# Altium schematic sheet BMS_Interface.SchDoc: BMS Interface
size Letter; Author: Kevin Chen; DocumentNumber: 3; SheetNumber: 3; SheetTotal: 4; Website: www.uwmidsun.com
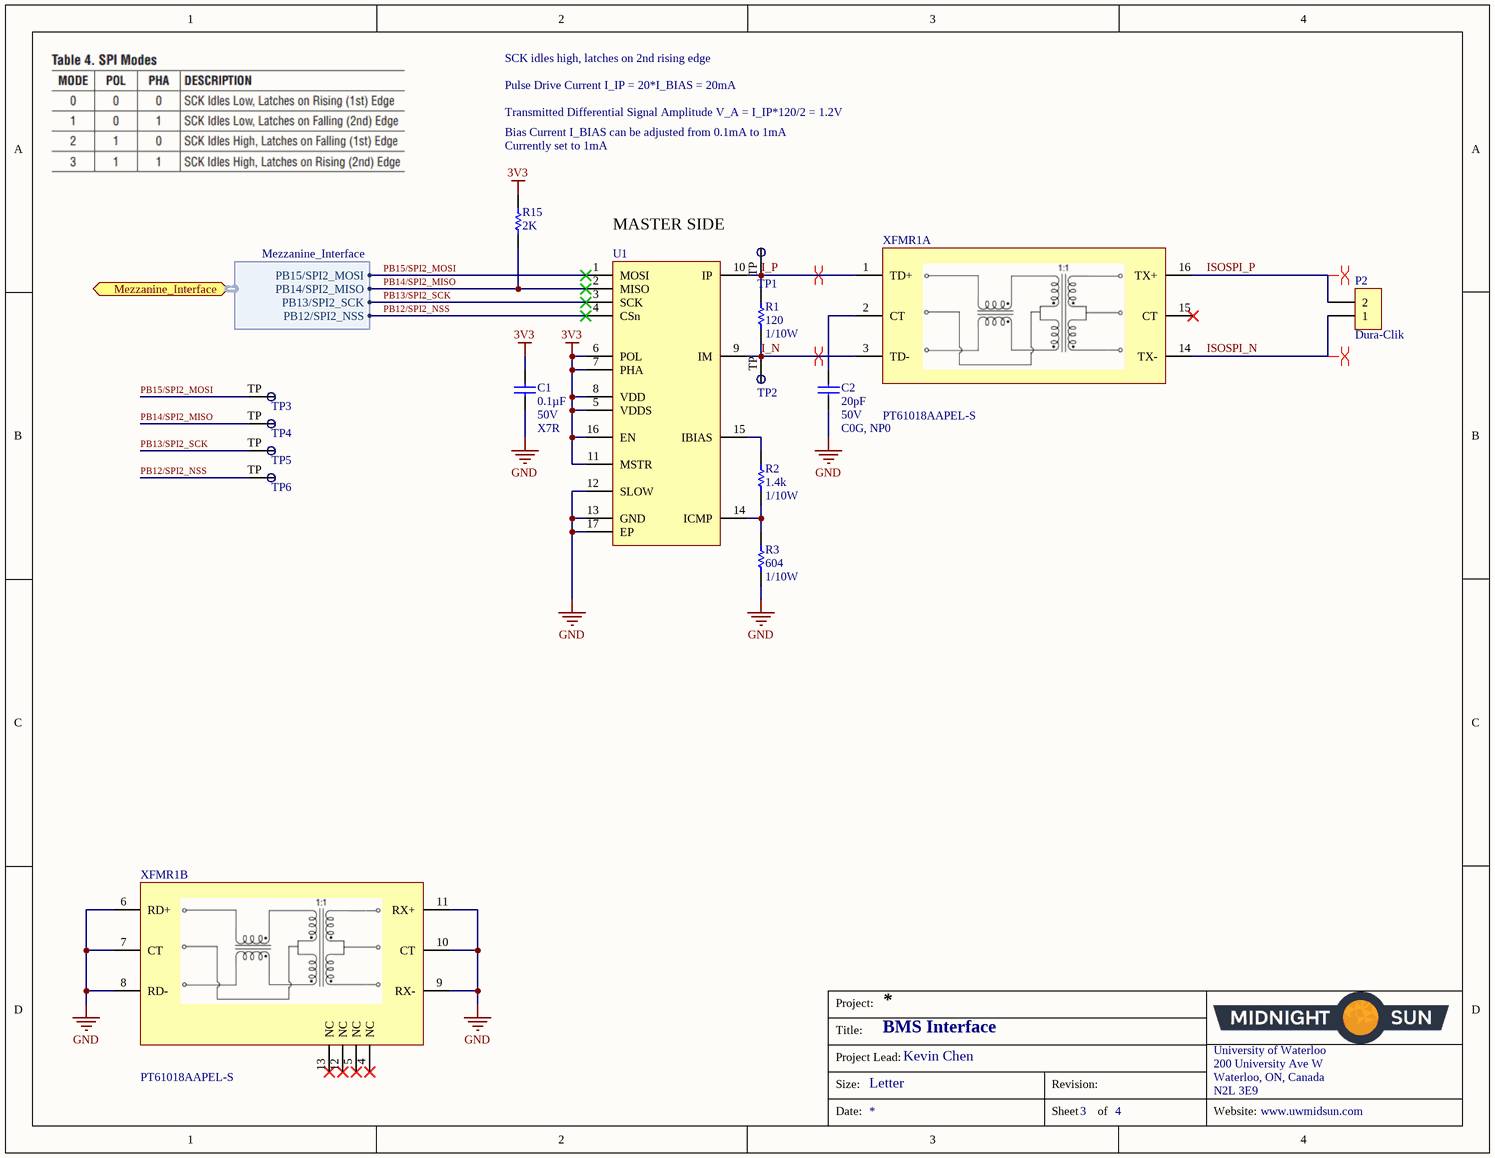
[diagram p0: BMS_Interface.SchDoc]

## Parts
C1  Capacitance: 0.1µF  Voltage: 50V  Temperature Coefficient: X7R  [CAP, 0603]  (hidden comment: CAP CER 0.1UF 50V 10% X7R 0603)
C2  Capacitance: 20pF  Voltage: 50V  Temperature Coefficient: C0G, NP0  [CAP, 0603]  (hidden comment: CAP CER 20PF 50V ±5% C0G/NP0 0603)
P2  Dura-Clik  [CONN, 2POS Dura-Click Vertical]
R1  Resistance: 120  Power: 1/10W  [RES, 0603]  (hidden comment: RES 120 OHM 1% 1/10W 0603)
R2  Resistance: 1.4k  Power: 1/10W  [RES, 0603]  (hidden comment: RES 1.4k OHM 1% 1/10W 0603)
R3  Resistance: 604  Power: 1/10W  [RES, 0603]  (hidden comment: RES 604 OHM 1% 1/10W 0603)
R15  2K  [RES, 0603]
TP1  Test Point  [Test Point]  (value not drawn)
TP2  Test Point  [Test Point]  (value not drawn)
TP3  Test Point  [Test Point]  (value not drawn)
TP4  Test Point  [Test Point]  (value not drawn)
TP5  Test Point  [Test Point]  (value not drawn)
TP6  Test Point  [Test Point]  (value not drawn)
U1  IC ISOSPI COMM INTERFACE LTC6820IUD  [IC COMM INTERFACE ISOSPI 16-QFN]  (value not drawn)
XFMR1  MFG_PN: PT61018AAPEL-S  [IC, PULSE XFMR 1CT:1CT 350UH SMD]  (hidden comment: IC PULSE XFMR 1CT:1CT 350UH SMD)  (parts A,B of 2)

## Ports
Mezzanine_Interface (harness Mezzanine_Interface)

## Harnesses
Mezzanine_Interface: PB15/SPI2_MOSI, PB14/SPI2_MISO, PB13/SPI2_SCK, PB12/SPI2_NSS

## Nets
3V3: C1.1 R15.1 U1.5(VDDS) U1.6(POL) U1.7(PHA) U1.8(VDD) U1.11(MSTR) U1.16(EN)
GND: C1.2 C2.2 R3.2 U1.12(SLOW) U1.13(GND) U1.17(EP) XFMR1.6(RD+) XFMR1.7(CT) XFMR1.8(RD-) XFMR1.9(RX-) XFMR1.10(CT) XFMR1.11(RX+)
I_N: R1.2 TP2.TP U1.9(IM) XFMR1.3(TD-)
I_P: R1.1 TP1.TP U1.10(IP) XFMR1.1(TD+)
ISOSPI_N: P2.1 XFMR1.14(TX-)
ISOSPI_P: P2.2 XFMR1.16(TX+)
PB12/SPI2_NSS: TP6.TP U1.4(CSn) ; port Mezzanine_Interface.PB12/SPI2_NSS
PB13/SPI2_SCK: TP5.TP U1.3(SCK) ; port Mezzanine_Interface.PB13/SPI2_SCK
PB14/SPI2_MISO: R15.2 TP4.TP U1.2(MISO) ; port Mezzanine_Interface.PB14/SPI2_MISO
PB15/SPI2_MOSI: TP3.TP U1.1(MOSI) ; port Mezzanine_Interface.PB15/SPI2_MOSI
NetC2_1: C2.1 XFMR1.2(CT)
NetR2_1: R2.1 U1.15(IBIAS)
NetR2_2: R2.2 R3.1 U1.14(ICMP)

Not connected (* = marked no-connect by the designer): XFMR1 4(NC)* 5(NC)* 12(NC)* 13(NC)* 15(CT)*

## Layout directives
differential pair: I_N, I_P, ISOSPI_N, ISOSPI_P

## Notes on the sheet
- Pulse Drive Current I_IP = 20*I_BIAS = 20mA
- SCK idles high, latches on 2nd rising edge
- Bias Current I_BIAS can be adjusted from 0.1mA to 1mA
- Currently set to 1mA
- Transmitted Differential Signal Amplitude V_A = I_IP*120/2 = 1.2V
- MASTER SIDE
- Project:
- Title:
- Size:
- Project Lead:
- Letter
- Revision:
- University of Waterloo
- 200 University Ave W
- Waterloo, ON, Canada
- N2L 3E9
- Date:
- Sheet
- of
- Website:

## Library data of the parts
C1 = CAP CER 0.1UF 50V 10% X7R 0603: 0.10µF ±10% 50V Ceramic Capacitor X7R 0603 (1608 Metric); Manufacturer 1: AVX Corporation; Manufacturer Part Number 1: 06035C104KAT2A; Supplier 1: Digi-Key; Supplier Part Number 1: 478-5052-1-ND; Packaging: Cut Tape (CT); Part Status: Active; Operating Temperature: -55°C ~ 125°C; Ratings: -; Mounting Type: Surface Mount, MLCC; Package / Case: 0603 (1608 Metric); Size / Dimension: 0.063" L x 0.032" W (1.60mm x 0.81mm); Height - Seated (Max): -; Thickness (Max): 0.035" (0.90mm); Lead Spacing: -; Lead Style: -; ComponentLink1URL: http://datasheets.avx.com/X7RDielectric.pdf; ComponentLink1Description: http://datasheets.avx.com/X7RDielectric.pdf; Tolerance: ±10%
C2 = CAP CER 20PF 50V ±5% C0G/NP0 0603: 20pF ±5% 50V Ceramic Capacitor C0G, NP0 0603 (1608 Metric); Manufacturer 1: Murata Electronics North America; Manufacturer Part Number 1: GRM1885C1H200JA01D; Supplier 1: Digi-Key; Supplier Part Number 1: 490-1410-1-ND; Packaging: Cut Tape (CT); Part Status: Active; Operating Temperature: -55°C ~ 125°C; Ratings: -; Mounting Type: Surface Mount, MLCC; Package / Case: 0603 (1608 Metric); Size / Dimension: 0.063" L x 0.031" W (1.60mm x 0.80mm); Height - Seated (Max): -; Thickness (Max): 0.035" (0.90mm); Lead Spacing: -; Lead Style: -; ComponentLink1URL: http://www.murata.com/~/media/webrenewal/support/library/catalog/products/capacitor/mlcc/c02e.ashx; ComponentLink1Description: http://www.murata.com/~/media/webrenewal/support/library/catalog/products/capacitor/mlcc/c02e.ashx; Tolerance: ±5%
P2 = CONN 2POS DURA-CLIK 0.079" VERT: 2 Positions Header, Shrouded Connector 0.079" (2.00mm) Surface Mount, Vertical Tin; Manufacturer: Molex, LLC; Manufacturer Part Number: 5600200220; Style: Board to Cable/Wire; Shrouding: Shrouded - 4 Wall; Number of Positions: 2; Number of Positions Loaded: All; Mated Stacking Heights: 9.3mm; Supplier 1: Digi-Key; RoHS: RoHS Compliant; Category: Connectors, Interconnects; Stock 1: 11912; Pricing 1: 1=1.16, 10=1.012, 25=0.952, 50=0.9122, 100=0.8727, 250=0.79336 (CAD); Packaging: Cut Tape (CT); Part Status: Active; Connector Type: Header; Contact Type: Male Pin; Pitch - Mating: 0.079" (2.00mm); Number of Rows: 1; Row Spacing - Mating: -; Mounting Type: Surface Mount; Termination: Solder; Fastening Type: Latch Lock; Contact Length - Mating: -; Contact Length - Post: -; Overall Contact Length: -; Insulation Height: 0.315" (8.00mm); Contact Shape: Square; Contact Finish - Mating: Tin; Contact Finish Thickness - Mating: -; Contact Finish - Post: Tin; Contact Material: Copper Alloy; Insulation Material: Polyamide (PA), Nylon; Features: Solder Retention; Operating Temperature: -; Ingress Protection: -; Material Flammability Rating: -; Insulation Color: Natural; Current Rating: -; Voltage Rating: -; Contact Finish Thickness - Post: -; Applications: Automotive, Industrial; ComponentLink1URL: http://www.molex.com/pdm_docs/sd/5600200220_sd.pdf; ComponentLink1Description: http://www.molex.com/pdm_docs/sd/5600200220_sd.pdf; Supplier Part Number 1: WM10862CT-ND
R1 = RES 120 OHM 1% 1/10W 0603: RES SMD 120 OHM 1% 1/10W 0603; Manufacturer 1: Yageo; Manufacturer Part Number 1: RC0603FR-07120RL; Temperature Coefficient: ±100ppm/°C; Supplier 1: Digi-Key; Supplier Part Number 1: 311-120HRCT-ND; Packaging: Cut Tape (CT); Part Status: Active; Composition: Thick Film; Operating Temperature: -55°C ~ 155°C; Package / Case: 0603 (1608 Metric); Supplier Device Package: 0603; Size / Dimension: 0.063" L x 0.031" W (1.60mm x 0.80mm); Height - Seated (Max): 0.022" (0.55mm); Failure Rate: -; ComponentLink1URL: http://www.yageo.com/documents/recent/PYu-RC_Group_51_RoHS_L_7.pdf; ComponentLink1Description: http://www.yageo.com/documents/recent/PYu-RC_Group_51_RoHS_L_7.pdf; Tolerance: ±1%
R2 = RES 1.4k OHM 1% 1/10W 0603: RES SMD 1.4K OHM 1% 1/10W 0603; Manufacturer 1: Yageo; Manufacturer Part Number 1: RC0603FR-071K4L; Temperature Coefficient: ±100ppm/°C; Supplier 1: Digi-Key; Supplier Part Number 1: 311-1.40KHRCT-ND; Packaging: Cut Tape (CT); Part Status: Active; Composition: Thick Film; Operating Temperature: -55°C ~ 155°C; Package / Case: 0603 (1608 Metric); Supplier Device Package: 0603; Size / Dimension: 0.063" L x 0.031" W (1.60mm x 0.80mm); Height - Seated (Max): 0.022" (0.55mm); Failure Rate: -; ComponentLink1URL: http://www.yageo.com/documents/recent/PYu-RC_Group_51_RoHS_L_7.pdf; ComponentLink1Description: http://www.yageo.com/documents/recent/PYu-RC_Group_51_RoHS_L_7.pdf; Tolerance: ±1%
R3 = RES 604 OHM 1% 1/10W 0603: RES SMD 604 OHM 1% 1/10W 0603; Manufacturer 1: Yageo; Manufacturer Part Number 1: RC0603FR-07604RL; Temperature Coefficient: ±100ppm/°C; Supplier 1: Digi-Key; Supplier Part Number 1: 311-604HRCT-ND; Packaging: Cut Tape (CT); Part Status: Active; Composition: Thick Film; Operating Temperature: -55°C ~ 155°C; Package / Case: 0603 (1608 Metric); Supplier Device Package: 0603; Size / Dimension: 0.063" L x 0.031" W (1.60mm x 0.80mm); Height - Seated (Max): 0.022" (0.55mm); Failure Rate: -; ComponentLink1URL: http://www.yageo.com/documents/recent/PYu-RC_Group_51_RoHS_L_7.pdf; ComponentLink1Description: http://www.yageo.com/documents/recent/PYu-RC_Group_51_RoHS_L_7.pdf; Tolerance: ±1%
R15 = RES 2K OHM 1% 1/10W 0603: 2k Ohm ±1% 0.1W, 1/10W Chip Resistor 0603 (1608 Metric) Moisture Resistant Thick Film; Manufacturer: Yageo; Manufacturer Part Number: RC0603FR-072KL; Temperature Coefficient: ±100ppm/°C; Supplier 1: Digi-Key; RoHS: RoHS Compliant; Category: Resistors; Stock 1: 1750701; Pricing 1: 1=0.15, 10=0.023, 100=0.0093, 1000=0.00415, 2500=0.0036 (CAD); Packaging: Cut Tape (CT); Part Status: Active; Resistance (Ohms): 2k; Tolerance: ±1%; Power (Watts): 0.1W, 1/10W; Composition: Thick Film; Features: Moisture Resistant; Operating Temperature: -55°C ~ 155°C; Package / Case: 0603 (1608 Metric); Supplier Device Package: 0603; Size / Dimension: 0.063" L x 0.031" W (1.60mm x 0.80mm); Height - Seated (Max): 0.022" (0.55mm); Failure Rate: -; ComponentLink1URL: http://www.yageo.com/documents/recent/PYu-RC_Group_51_RoHS_L_7.pdf; ComponentLink1Description: http://www.yageo.com/documents/recent/PYu-RC_Group_51_RoHS_L_7.pdf; Supplier Part Number 1: 311-2.00KHRCT-ND
U1 = IC ISOSPI COMM INTERFACE LTC6820IUD: IC COMM INTERFACE ISOSPI 16-QFN; Manufacturer: Linear Technology; Manufacturer Part Number: LTC6820IUD#PBF; Interface: SPI; Voltage - Supply: 2.7 V ~ 5.5 V; Supplier 1: Digi-Key; Supplier Part Number 1: LTC6820IUD#PBF-ND; RoHS: RoHS Compliant; Category: Integrated Circuits (ICs); Stock 1: 827; Pricing 1: 1=7.35, 25=4.8816, 100=4.0066 (CAD); Packaging: Tube; Part Status: Active; Applications: Isolated Communications Interface; Package / Case: 16-WFQFN Exposed Pad; Supplier Device Package: 16-QFN (3x3); Mounting Type: Surface Mount; ComponentLink1URL: http://www.linear.com/docs/42317; ComponentLink1Description: http://www.linear.com/docs/42317
XFMR1 = IC PULSE XFMR 1CT:1CT 350UH SMD: PULSE XFMR 1CT:1CT 350UH SMD; Manufacturer: Bourns Inc.; Isolation Voltage: 1.5kVrms; Supplier: Digikey; Supplier_PN: PT61018AAPEL-SCT-ND; Inductance: 350uH; Supplier 1: Digi-Key; Supplier Part Number 1: PT61018AAPEL-SCT-ND